# EAGLE schematic ThesisBrd (EAGLE 9.2.2)
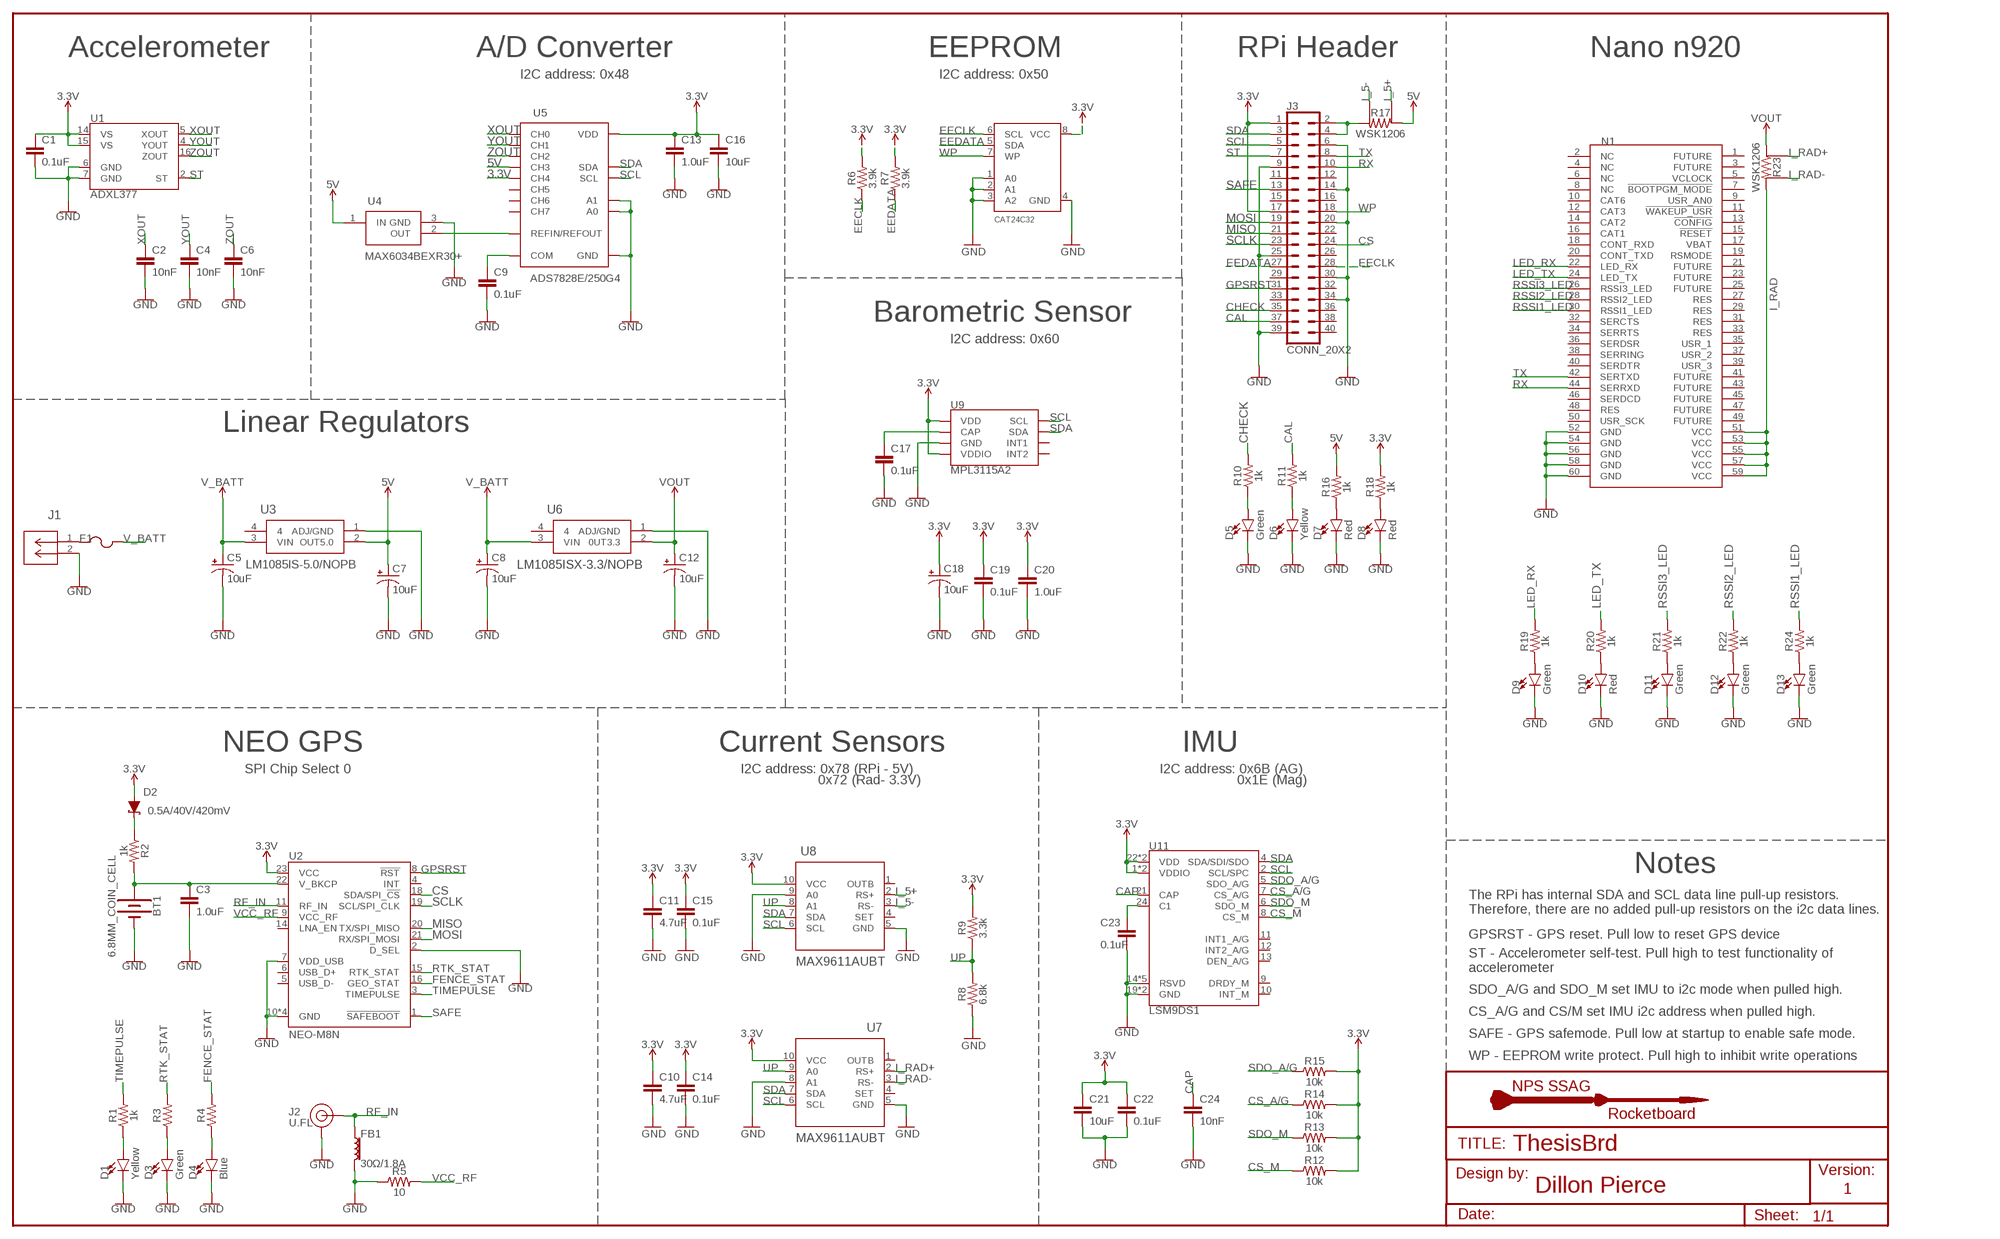
[diagram p0: schematic, sheet 1]

## Parts
BT1  6.8MM_COIN_CELL  BATTERY-6.8MM_SMD  [BATTCON-6.8MM]
C1  0.1uF  0.1UF-0603-25V-(+80/-20%)  [0603]
C2  10nF  10NF-0603-50V-10%  [0603]
C3  1.0uF  1.0UF-0603-16V-10%  [0603]
C4  10nF  10NF-0603-50V-10%  [0603]
C5  10uF  10UF-POLAR-0603-6.3V-20%(TANT)  [0603-POLAR]
C6  10nF  10NF-0603-50V-10%  [0603]
C7  10uF  10UF-POLAR-0603-6.3V-20%(TANT)  [0603-POLAR]
C8  10uF  10UF-POLAR-0603-6.3V-20%(TANT)  [0603-POLAR]
C9  0.1uF  0.1UF-0603-25V-(+80/-20%)  [0603]
C10  4.7uF  4.7UF0603  [0603]
C11  4.7uF  4.7UF0603  [0603]
C12  10uF  10UF-POLAR-0603-6.3V-20%(TANT)  [0603-POLAR]
C13  1.0uF  1.0UF-0603-16V-10%  [0603]
C14  0.1uF  0.1UF-0603-25V-(+80/-20%)  [0603]
C15  0.1uF  0.1UF-0603-25V-(+80/-20%)  [0603]
C16  10uF  10UF-0603-6.3V-20%  [0603]
C17  0.1uF  0.1UF-0603-25V-(+80/-20%)  [0603]
C18  10uF  10UF-POLAR-0603-6.3V-20%(TANT)  [0603-POLAR]
C19  0.1uF  0.1UF-0603-25V-(+80/-20%)  [0603]
C20  1.0uF  1.0UF-0603-16V-10%  [0603]
C21  10uF  10UF-0603-6.3V-20%  [0603]
C22  0.1uF  0.1UF-0603-25V-(+80/-20%)  [0603]
C23  0.1uF  0.1UF-0603-25V-(+80/-20%)  [0603]
C24  10nF  10NF-0603-50V-10%  [0603]
D1  Yellow  LED-YELLOW0603  [LED-0603]
D2  0.5A/40V/420mV  DIODE-SCHOTTKY-PMEG4005EJ  [SOD-323]
D3  Green  LED-GREEN0603  [LED-0603]
D4  Blue  LED-BLUE0603  [LED-0603]
D5  Green  LED-GREEN0603  [LED-0603]
D6  Yellow  LED-YELLOW0603  [LED-0603]
D7  Red  LED-RED0603-SMART  [LED-0603]
D8  Red  LED-RED0603-SMART  [LED-0603]
D9  Green  LED-GREEN0603  [LED-0603]
D10  Red  LED-RED0603-SMART  [LED-0603]
D11  Green  LED-GREEN0603  [LED-0603]
D12  Green  LED-GREEN0603  [LED-0603]
D13  Green  LED-GREEN0603  [LED-0603]
F1  1206SFF400F/32-2  [FUS1206_TYCO]
FB1  30Ω/1.8A  FERRITE_BEAD-0603  [0603]
J1  5-103635-1  [CONN_5-103635-1_TYCO]
J2  U.FL  U.FL2PIN  [U.FL]
J3  CONN_20X2  [2X20]
N1  N920  [N920]
R1  1k  1KOHM-0603-1/10W-1%  [0603]
R2  1k  1KOHM-0603-1/10W-1%  [0603]
R3  1KOHM-0603-1/10W-1%  [0603]
R4  1KOHM-0603-1/10W-1%  [0603]
R5  10  10OHM-0603-1/10W-1%  [0603]
R6  3.9k  3.9KOHM-0603-1/10W-1%  [0603]
R7  3.9k  3.9KOHM-0603-1/10W-1%  [0603]
R8  6.8k  6.8KOHM-0603-1/10W-1%  [0603]
R9  3.3k  3.3KOHM-0603-1/10W-1%  [0603]
R10  1k  1KOHM-0603-1/10W-1%  [0603]
R11  1k  1KOHM-0603-1/10W-1%  [0603]
R12  10k  10KOHM-0603-1/10W-1%  [0603]
R13  10k  10KOHM-0603-1/10W-1%  [0603]
R14  10k  10KOHM-0603-1/10W-1%  [0603]
R15  10k  10KOHM-0603-1/10W-1%  [0603]
R16  1k  1KOHM-0603-1/10W-1%  [0603]
R17  WSK1206  [WSK1206]
R18  1k  1KOHM-0603-1/10W-1%  [0603]
R19  1k  1KOHM-0603-1/10W-1%  [0603]
R20  1k  1KOHM-0603-1/10W-1%  [0603]
R21  1k  1KOHM-0603-1/10W-1%  [0603]
R22  1k  1KOHM-0603-1/10W-1%  [0603]
R23  WSK1206  [WSK1206]
R24  1k  1KOHM-0603-1/10W-1%  [0603]
U1  ADXL377  [LFCSP-16-3X3]
U2  NEO-M8N  NEO-M8PM8P  [NEO-M8P]
U3  LM1085IS-5.0/NOPB  [TS3B]
U4  MAX6034BEXR30+  [21-0075D]
U5  ADS7828E/250G4  [PW16]
U6  LM1085ISX-3.3/NOPB  [TS3B]
U7  MAX9611AUBT  [21-0061L]
U8  MAX9611AUBT  [21-0061L]
U9  MPL3115A2  [LGA-8-5X3]
U10  CAT24C32  EEPROM_I2C_SOIC8_GENERIC  [SOIC8_150MIL]
U11  LSM9DS1  [LGA-24-3.5X3]

## Nets
3.3V: C1.1 C10.1 C11.1 C13.1 C14.1 C15.1 C16.1 C18.+ C19.1 C20.1 C21.1 C22.1 D2.A J3.1 J3.17 R6.2 R7.2 R9.2 R12.2 R13.2 R14.2 R15.2 R18.2 U1.14(VS) U1.15(VS) U2.23(VCC) U5.5(CH4) U5.16(VDD) U7.10(VCC) U8.10(VCC) U9.1(VDD) U9.4(VDDIO) U10.8(VCC) U11.1(VDDIO) U11.3(VDDIO) U11.22(VDD) U11.23(VDD)
5V: C7.+ R16.2 R17.VIN U3.2(OUT5.0) U4.1(IN) U5.4(CH3)
BACKUP: BT1.+ C3.1 R2.2 U2.22(V_BKCP)
CAL: J3.37 R11.2
CAP: C24.1 U11.21(CAP)
CHECK: J3.35 R10.2
CS: J3.24 U2.18(SDA/SPI_!CS!)
CS_A/G: R14.1 U11.7(CS_A/G)
CS_M: R12.1 U11.8(CS_M)
EECLK: J3.28 R6.1 U10.6(SCL)
EEDATA: J3.27 R7.1 U10.5(SDA)
FENCE_STAT: R4.2 U2.16(GEO_STAT)
GND: BT1.- C1.2 C2.2 C3.2 C4.2 C5.- C6.2 C7.- C8.- C9.2 C10.2 C11.2 C12.- C13.2 C14.2 C15.2 C16.2 C17.2 C18.- C19.2 C20.2 C21.2 C22.2 C23.2 C24.2 D1.C D3.C D4.C D5.C D6.C D7.C D8.C D9.C D10.C D11.C D12.C D13.C FB1.2 J1.2 J2.1(GND) J2.2(GND) J3.6 J3.9 J3.14 J3.20 J3.25 J3.30 J3.34 J3.39 N1.52(GND) N1.54(GND) N1.56(GND) N1.58(GND) N1.60(GND) R5.1 R8.1 U1.6(GND) U1.7(GND) U2.2(D_SEL) U2.7(VDD_USB) U2.10(GND) U2.12(GND) U2.13(GND) U2.24(GND) U3.1(ADJ/GND) U4.3(GND) U5.9(GND) U5.12(A0) U5.13(A1) U6.1(ADJ/GND) U7.5(GND) U7.8(A1) U8.5(GND) U8.9(A0) U9.3(GND) U10.1(A0) U10.2(A1) U10.3(A2) U10.4(GND) U11.14(RSVD) U11.15(RSVD) U11.16(RSVD) U11.17(RSVD) U11.18(RSVD) U11.19(GND) U11.20(GND)
GPSRST: J3.31 U2.8(!RST)
I_5+: R17.I_(+) U8.2(RS+)
I_5-: R17.I_(-) U8.3(RS-)
I_RAD: N1.51(VCC) N1.53(VCC) N1.55(VCC) N1.57(VCC) N1.59(VCC) R23.VOUT
I_RAD+: R23.I_(+) U7.2(RS+)
I_RAD-: R23.I_(-) U7.3(RS-)
LED_RX: N1.22(LED_RX) R19.2
LED_TX: N1.24(LED_TX) R20.2
MISO: J3.21 U2.20(TX/SPI_MISO)
MOSI: J3.19 U2.21(RX/SPI_MOSI)
N$1: C9.1 U5.11(COM)
N$2: D8.A R18.1
N$3: D2.C R2.1
N$4: D1.A R1.1
N$5: D3.A R3.1
N$6: D4.A R4.1
N$7: C17.1 U9.2(CAP)
N$8: C23.1 U11.24(C1)
N$9: U4.2(OUT) U5.10(REFIN/REFOUT)
N$10: D7.A R16.1
N$11: D6.A R11.1
N$12: D5.A R10.1
N$13: D12.A R22.1
N$14: D10.A R20.1
N$15: D11.A R21.1
N$16: D9.A R19.1
N$17: D13.A R24.1
N$18: F1.1 J1.1
RF_IN: FB1.1 J2.FEED(SIGNAL) U2.11(RF_IN)
RSSI1_LED: N1.30(RSSI1_LED) R24.2
RSSI2_LED: N1.28(RSSI2_LED) R22.2
RSSI3_LED: N1.26(RSSI3_LED) R21.2
RTK_STAT: R3.2 U2.15(RTK_STAT)
RX: J3.10 N1.44(SERRXD)
SAFE: J3.13 U2.1(!SAFEBOOT!)
SCL: J3.5 U5.14(SCL) U7.6(SCL) U8.6(SCL) U9.8(SCL) U11.2(SCL/SPC)
SCLK: J3.23 U2.19(SCL/SPI_CLK)
SDA: J3.3 U5.15(SDA) U7.7(SDA) U8.7(SDA) U9.7(SDA) U11.4(SDA/SDI/SDO)
SDO_A/G: R15.1 U11.5(SDO_A/G)
SDO_M: R13.1 U11.6(SDO_M)
ST: J3.7 U1.2(ST)
TIMEPULSE: R1.2 U2.3(TIMEPULSE)
TX: J3.8 N1.42(SERTXD)
UP: R8.2 R9.1 U7.9(A0) U8.8(A1)
V_BATT: C5.+ C8.+ F1.2 U3.3(VIN) U6.3(VIN)
V_PI: J3.2 J3.4 R17.VOUT
VCC_RF: R5.2 U2.9(VCC_RF)
VOUT: C12.+ R23.VIN U6.2(0UT3.3)
WP: J3.18 U10.7(WP)
XOUT: C2.1 U1.5(XOUT) U5.1(CH0)
YOUT: C4.1 U1.4(YOUT) U5.2(CH1)
ZOUT: C6.1 U1.16(ZOUT) U5.3(CH2)
Unconnected: J3.11 J3.12 J3.15 J3.16 J3.22 J3.26 J3.29 J3.32 J3.33 J3.36 J3.38 J3.40 N1.1(FUTURE) N1.2(NC) N1.3(FUTURE) N1.4(NC) N1.5(VCLOCK) N1.6(NC) N1.7(!BOOTPGM_MODE) N1.8(NC) N1.9(USR_AN0) N1.10(CAT6) N1.11(!WAKEUP_USR) N1.12(CAT3) N1.13(!CONFIG) N1.14(CAT2) N1.15(!RESET) N1.16(CAT1) N1.17(VBAT) N1.18(CONT_RXD) N1.19(RSMODE) N1.20(CONT_TXD) N1.21(FUTURE) N1.23(FUTURE) N1.25(FUTURE) N1.27(RES) N1.29(RES) N1.31(RES) N1.32(SERCTS) N1.33(RES) N1.34(SERRTS) N1.35(USR_1) N1.36(SERDSR) N1.37(USR_2) N1.38(SERRING) N1.39(USR_3) N1.40(SERDTR) N1.41(FUTURE) N1.43(FUTURE) N1.45(FUTURE) N1.46(SERDCD) N1.47(FUTURE) N1.48(RES) N1.49(FUTURE) N1.50(USR_SCK) U2.4(INT) U2.5(USB_D-) U2.6(USB_D+) U2.14(LNA_EN) U3.4 U5.6(CH5) U5.7(CH6) U5.8(CH7) U6.4 U7.1(OUTB) U7.4(SET) U8.1(OUTB) U8.4(SET) U9.5(INT2) U9.6(INT1) U11.9(DRDY_M) U11.10(INT_M) U11.11(INT1_A/G) U11.12(INT2_A/G) U11.13(DEN_A/G)

## Notes on the sheet
- Accelerometer | A/D Converter | EEPROM | RPi Header | Nano n920
- I2C address: 0x48 | I2C address: 0x50
- Barometric Sensor
- I2C address: 0x60
- Linear Regulators
- NEO GPS | Current Sensors | IMU
- SPI Chip Select 0 | I2C address: 0x78 (RPi - 5V) | I2C address: 0x6B (AG)
- 0x72 (Rad- 3.3V) | 0x1E (Mag)
- Notes
- The RPi has internal SDA and SCL data line pull-up resistors.
  Therefore, there are no added pull-up resistors on the i2c data lines.
- GPSRST - GPS reset. Pull low to reset GPS device
- ST - Accelerometer self-test. Pull high to test functionality of 
  accelerometer
- SDO_A/G and SDO_M set IMU to i2c mode when pulled high.
- CS_A/G and CS/M set IMU i2c address when pulled high.
- SAFE - GPS safemode. Pull low at startup to enable safe mode.
- WP - EEPROM write protect. Pull high to inhibit write operations
- NPS SSAG
- Rocketboard
- TITLE:
- Design by: | Version:
- Dillon Pierce | 1
- Date: | Sheet:

## Library data of the parts
BT1 = SparkFun-Batteries:BATTERY: Battery - Single Cell A variety of battery chemistries, sizes, and footprints. Device List: 20MM_PTH - Coin Cell Battery Holder - 20mm (PTH) <https://www.sparkfun.com/products/783> 20MM_PTH_KIT- Coin Cell battery Holder - 20 mm (PTH) <http://www.sparkfun.com/products/783>kit version with special mask 6.8MM_PTH - Coin Cell Battery Holder - 6.8MM(SMD) <https://www.digikey.com/product-detail/en/seiko-instruments/MS621FE-FL11E/728-1057-ND/1889208?WT.srch=1&gclid=CNOQ5a6LzdQCFZS2wAodXCkE0g> 12MM_SMD - Coin Cell Battery Holder - 12mm (SMD) <https://www.sparkfun.com/products/10592> 12MM_PTH - Coin Cell Battery Holder - 12mm (PTH) <https://www.sparkfun.com/products/7948> 20MM_SMD - 20mm Coin Cell Battery Holder (SMD) (2 legs) Used on the Big Time Watch Kit <https://www.sparkfun.com/products/11734> 20MM_SMD_4LEGS - Coin Cell Battery Holder - 20mm (SMD) <https://www.sparkfun.com/products/11892> 20MM_SMD_4LEGS_OVERPASTE - Coin Cell Battery Holder - 20mm (SMD) <https://www.sparkfun.com/products/11892> (Over-paste on the legs) 24.5MM_PTH - Coin Cell Battery Holder - 24.5mm (PTH) <https://www.sparkfun.com/products/8863> 9V - 9V Battery Holder - PC Mount Used on the SparkFun SparkPunk Sound Kit <https://www.sparkfun.com/products/11177> and SparkFun SparkPunk Sequencer Kit <https://www.sparkfun.com/products/12707> 18650 - Battery Holder - 18650 (PTH) <https://www.sparkfun.com/products/13113> AA - Battery Holder - 1xAA (PTH) <https://www.sparkfun.com/products/7949> AAA - Battery Holder - 1xAAA (PTH) <https://www.sparkfun.com/products/12718> AA_KIT - Battery Holder - 1xAA (PTH) <https://www.sparkfun.com/products/7949> Special kit package - pads only have exposed copper on one side of the board. AAA_KIT - Battery Holder - 1xAAA (PTH) <https://www.sparkfun.com/products/12718> Special kit package - pads only have exposed copper on one side of the board.; PROD_ID: BATT-13734
C1 C9 C14 C15 C17 C19 C22 C23 = SparkFun-Capacitors:0.1UF: 0.1µF ceramic capacitors A capacitor is a passive two-terminal electrical component used to store electrical energy temporarily in an electric field.; PROD_ID: CAP-00810
C2 C4 C6 C24 = SparkFun-Capacitors:10NF: 0.01uF/10nF/10,000pF ceramic capacitors A capacitor is a passive two-terminal electrical component used to store electrical energy temporarily in an electric field. CAP-09321; PROD_ID: CAP-00867
C3 C13 C20 = SparkFun-Capacitors:1.0UF: 1µF ceramic capacitors A capacitor is a passive two-terminal electrical component used to store electrical energy temporarily in an electric field.; PROD_ID: CAP-00868
C5 C7 C8 C12 C18 = SparkFun-Capacitors:10UF-POLAR: 10.0µF polarized capacitors A capacitor is a passive two-terminal electrical component used to store electrical energy temporarily in an electric field.; PROD_ID: CAP-13210
C10 C11 = SparkFun-Capacitors:4.7UF: 4.7µF ceramic capacitors A capacitor is a passive two-terminal electrical component used to store electrical energy temporarily in an electric field.; PROD_ID: CAP-08280
C16 C21 = SparkFun-Capacitors:10UF: 10.0µF ceramic capacitors A capacitor is a passive two-terminal electrical component used to store electrical energy temporarily in an electric field.; PROD_ID: CAP-11015
D1 D6 = SparkFun-LED:LED-YELLOW: Yellow SMD LED Used in manufacturing several products at SparkFun. Packages: 0603 - SMD 0603 package[Product Link] <http://www.kingbrightusa.com/product.asp?catalog_name=LED&product_id=APT1608SYCK> 0603 -SMART - SMART SMD 0603 package (more efficient/more expensive) [Product Link] <http://www.osram-os.com/osram_os/en/products/product-catalog/led-light-emitting-diodes/smartled-0603/ly-l29k/index.jsp> LilyPad - SMD1206 package[Product Datasheet] <https://www.sparkfun.com/datasheets/DevTools/LilyPad/Q150YUS4.pdf> SparkFun Products: Blynk Board <https://www.sparkfun.com/products/13794> IOIO-OTG <https://www.sparkfun.com/products/13613> XBee Explorer Serial <https://www.sparkfun.com/products/13225>; PROD_ID: DIO-09003
D2 = SparkFun-DiscreteSemi:DIODE-SCHOTTKY: Schottky diode A Schottky diode is a semiconductor diode which has a low forward voltage drop and a very fast switching action.; PROD_ID: DIO-10955
D3 D5 D9 D11-D13 = SparkFun-LED:LED-GREEN: Green SMD LED Used in manufacturing of various products at SparkFun Packages: 0603 - SMD 0603 package [Product Link] <http://www.futureelectronics.com/en/technologies/semiconductors/optoelectronics/leds/Pages/9894312-LTST-C190GKT.aspx?CrossPart=HSMG-C190&IM=0> LilyPad 1206 - SMD1206 LilyPad package [Product Link] <http://www.futureelectronics.com/en/Technologies/Product.aspx?ProductID=IN150NGHARVATEKCORPORATION2049943&IM=0> 1206 - SMD1206 package [Product Link] <http://www.futureelectronics.com/en/technologies/semiconductors/optoelectronics/leds/Pages/8315665-LTST-C150KGKT.aspx?IM=0> 1206 Bottom Mount -SMD 1206 Bottom Mount [Product Link] <http://www.digikey.com/product-detail/en/lite-on-inc/LTST-C230KGKT/160-1456-1-ND/386854> SparkFun Products: Pro Mini 328 -5V <https://www.sparkfun.com/products/821> RedBoard <https://www.sparkfun.com/products/12757> MP3 Trigger <https://www.sparkfun.com/products/13720> Makey Makey <https://www.sparkfun.com/products/11076>; PROD_ID: DIO-00821; VALUE: GREEN
D4 = SparkFun-LED:LED-BLUE: Blue SMD LED Used in manufacturing of various products at SparkFun Packages: 0603 - SMD 0603 package [Product Link] <http://www.digikey.com/product-detail/en/SMLE12BC7TT86/511-1589-2-ND/1641808> 1206 - SMD1206 package [Product Link] <http://www.digikey.com/product-detail/en/lite-on-inc/LTST-C150TBKT/160-1643-1-ND/573584> SparkFun Products: ESP8266 Thing-Dev Board <https://www.sparkfun.com/products/13711> RedBoard <https://www.sparkfun.com/products/12757>; PROD_ID: DIO-08575; VALUE: BLUE
D7 D8 D10 = SparkFun-LED:LED-RED: Red SMD LED Used in manufacturing of most products at SparkFun Packages: 0603 - SMD 0603 package [Product Link] <http://docs.avagotech.com/docs/AV02-0551EN> 0603 SMART - SMD 0603 SMART package ( more efficient and expensive)[Product Link] <http://www.osram-os.com/Graphics/XPic2/00077099_0.pdf> 1206 - SMD1206 package [Product Link] <https://www.sparkfun.com/datasheets/DevTools/LilyPad/Q150OVS4.pdff> SparkFun Products: Pro Mini 328 -5V <https://www.sparkfun.com/products/821> RedBoard <https://www.sparkfun.com/products/12757> IOIO-OTG <https://www.sparkfun.com/products/13613>; PROD_ID: DIO-11154
F1 = my-library:1206SFF400F/32-2; MANUFACTURER_PART_NUMBER: 4A 32V; VENDOR: Littelfuse Inc
FB1 = SparkFun-Coils:FERRITE_BEAD: Ferrite Bead (blocks, cores, rings, chokes, etc.) Inductor with layers of ferrite used to suppress high frequencies. Often used to isolate high frequency noise. SparkFun Products: IOIO-OTG - V2.2 <https://www.sparkfun.com/products/13613> SparkFun SAMD21 Mini Breakout <https://www.sparkfun.com/products/13664> SparkFun 6 Degrees of Freedom Breakout - LSM6DS3 <https://www.sparkfun.com/products/13339> SparkFun SAMD21 Dev Breakout <https://www.sparkfun.com/products/13672>; PROD_ID: NDUC-13805
J1 = my-library:5-103635-1; MANUFACTURER_PART_NUMBER: 51036351; VENDOR: TE Connectivity
J2 = SparkFun-Connectors:U.FL2PIN: SMD Antenna Connector - U.FL 2mm height, 3.0mm x 3.0mm receptacle size. SparkFun Products: SparkFun WiFi Shield - ESP8266 <https://www.sparkfun.com/products/13287> SparkFun ESP8266 Thing <https://www.sparkfun.com/products/13231> SparkFun MiniGen - Pro Mini Signal Generator Shield <https://www.sparkfun.com/products/11420>; PROD_ID: CONN-09193; SF_ID: WRL-09144
J3 = SparkFun-Connectors:CONN_20X2: Multi connection point. Often used as Generic Header-pin footprint for 0.1 inch spaced/style header connections On any of the 0.1 inch spaced packages, you can populate with these: Break Away Headers - Straight <https://www.sparkfun.com/products/116> (PRT-00116) Break Away Male Headers - Right Angle <https://www.sparkfun.com/products/553> (PRT-00553) Female Headers <https://www.sparkfun.com/products/115> (PRT-00115) Break Away Headers - Machine Pin <https://www.sparkfun.com/products/117> (PRT-00117) Break Away Female Headers - Swiss Machine Pin <https://www.sparkfun.com/products/743> (PRT-00743)
N1 = my-library:N920: The Nano Series Nano Series is capable of delivering high-performance wireless serial communications in a variety of network topologies. The Nano series is available as an OEM modem, as part of a development /interface kit or as a Enclosed modem. When properly configured and installed, long range communications at very high speeds can be achieved. Nano Series modules operate within the 902-928MHz or 2.4000-2.4835GHz ISM frequency bands, using frequency hopping spread spectrum (FHSS) technology. They provide reliable wireless asynchronous data transfer between most equipment types which employ an RS232, RS422, or RS485 interface.
R1 R2 R10 R11 R16 R18-R22 R24 = SparkFun-Resistors:1KOHM: 1kΩ resistor A resistor is a passive two-terminal electrical component that implements electrical resistance as a circuit element. Resistors act to reduce current flow, and, at the same time, act to lower voltage levels within circuits. - Wikipedia; PROD_ID: RES-07856
R3 R4 = SparkFun-Resistors:1KOHM: 1kΩ resistor A resistor is a passive two-terminal electrical component that implements electrical resistance as a circuit element. Resistors act to reduce current flow, and, at the same time, act to lower voltage levels within circuits. - Wikipedia; PROD_ID: RES-07856; VALUE: 1k
R5 = SparkFun-Resistors:10OHM: 10Ω resistor A resistor is a passive two-terminal electrical component that implements electrical resistance as a circuit element. Resistors act to reduce current flow, and, at the same time, act to lower voltage levels within circuits. - Wikipedia; PROD_ID: RES-12581
R6 R7 = SparkFun-Resistors:3.9KOHM: 3.9kΩ resistor A resistor is a passive two-terminal electrical component that implements electrical resistance as a circuit element. Resistors act to reduce current flow, and, at the same time, act to lower voltage levels within circuits. - Wikipedia; PROD_ID: RES-08701
R8 = SparkFun-Resistors:6.8KOHM: 6.8kΩ resistor A resistor is a passive two-terminal electrical component that implements electrical resistance as a circuit element. Resistors act to reduce current flow, and, at the same time, act to lower voltage levels within circuits. - Wikipedia; PROD_ID: RES-08597
R9 = SparkFun-Resistors:3.3KOHM: 3.3kΩ resistor A resistor is a passive two-terminal electrical component that implements electrical resistance as a circuit element. Resistors act to reduce current flow, and, at the same time, act to lower voltage levels within circuits. - Wikipedia; PROD_ID: RES-07851
R12-R15 = SparkFun-Resistors:10KOHM: 10kΩ resistor A resistor is a passive two-terminal electrical component that implements electrical resistance as a circuit element. Resistors act to reduce current flow, and, at the same time, act to lower voltage levels within circuits. - Wikipedia; PROD_ID: RES-00824
R17 R23 = my-library:WSK1206
U1 = SparkFun-Sensors:ADXL377: Analog Devices ADXL377 Low Power 3-Axis ±200 g Accelerometer with Analog Output The ADXL377 is a small, thin, low power, complete 3-axis accelerometer with signal conditioned voltage outputs. The ADXL377 measures acceleration resulting from motion, shock, or vibration with a typical full-scale range of ±200g. Datasheet <https://cdn.sparkfun.com/datasheets/Sensors/Accelerometers/ADXL377.pdf> SparkFun Products SparkFun Triple Axis Accelerometer Breakout - ADXL377 <https://www.sparkfun.com/products/12803> (SEN-12803); PROD_ID: IC-12027
U2 = NEO-M8P:NEO-M8P; PROD_ID: IC-14069
U3 = my-library:LM1085IS-5.0/NOPB; MANUFACTURER_PART_NUMBER: LM1085IS5.0NOPB; VENDOR: Texas Instruments
U4 = my-library:MAX6034BEXR30+; MANUFACTURER_PART_NUMBER: MAX6034BEXR30+; VENDOR: Maxim Integrated Products
U5 = my-library:ADS7828E/250G4; MANUFACTURER_PART_NUMBER: ADS7828E250G4; VENDOR: Texas Instruments
U6 = my-library:LM1085ISX-3.3/NOPB; MANUFACTURER_PART_NUMBER: LM1085ISX3.3NOPB; VENDOR: Texas Instruments
U7 U8 = MAX9611AUBT:MAX9611AUBT; DESCRIPTION: OP Amp and Comparator 10-Pin uMAX T/R; DIGI-KEY_PART_NUMBER: MAX9611AUB+CT-ND; DIGI-KEY_PURCHASE_URL: https://www.digikey.com/product-detail/en/maxim-integrated/MAX9611AUB-T/MAX9611AUB-CT-ND/5405899?utm_source=snapeda&utm_medium=aggregator&utm_campaign=symbol; MF: Maxim Integrated; MP: MAX9611AUB+T; PACKAGE: MSOP-10 Maxim Integrated
U9 = SparkFun-Sensors:MPL3115A2: NXP MPL3115A2 Digital Altimeter/Pressure Sensor The MPL3115A2 is a compact piezoresistive absolute pressure sensor with an I2C interface. MPL3115 has a wide operating range of 20kPa to 110 kPa, a range that covers all surface elevations on Earth. The fully internally compensated MEMS in conjunction with an embedded high resolution 24-bit equivalent ADC provide accurate pressure [Pascals] /altitude [meters] and temperature [degrees Celsius] data. Datasheet <http://cdn.sparkfun.com/datasheets/Sensors/Pressure/MPL3115A2.pdf> SparkFun Products SparkFun Altitude/Pressure Sensor Breakout - MPL3115A2 <https://www.sparkfun.com/products/11084> (SEN-11084) SparkFun Weather Shield <https://www.sparkfun.com/products/12081> (DEV-12081) SparkFun Photon Weather Shield <https://www.sparkfun.com/products/13630> (DEV-13630); PROD_ID: IC-10869
U10 = microbuilder:EEPROM_I2C_SOIC8_GENERIC: Note: The same pinout is used for many I2C EEPROMs in SOIC8(150mil) from a variety of manufacturers and in various sizes. Examples: 16K (2K x 8 Bit) I2C EEPROM 1.7-5.5V, 400KHz, -40°C-85°C Digikey: CAT24C16WI-GT3CT-ND 256K (32K x 8 Bit) I2C EEPROM 1.7-5.5V, 400KHz, -40°C-85°C Digikey: 24AA256-I/SN-ND
U11 = SparkFun-Sensors:LSM9DS1: ST Microelectronics LSM9DS1 9DOF IMU - Accelerometer, Gyroscope & Magnetometer The LSM9DS1 is a versatile, motion-sensing system-in-a-chip. It houses a 3-axis accelerometer, 3-axis gyroscope, and 3-axis magnetometer – nine degrees of freedom (9DOF) in a single IC! The LSM9DS1 is equipped with a digital interface, but even that is flexible: it supports both I2C and SPI, so you’ll be hard-pressed to find a microcontroller it doesn’t work with. Datasheet <https://cdn.sparkfun.com/assets/learn_tutorials/3/7/3/LSM9DS1_Datasheet.pdf> SparkFun Products SparkFun 9 Degrees of Freedom IMU Breakout - LSM9DS1 <https://www.sparkfun.com/products/13284> (SEN-13284) SparkFun Photon IMU Shield <https://www.sparkfun.com/products/13629> (DEV-13629); PROD_ID: IC-12536

## Net classes
2 3.3V: width 0.508 mm